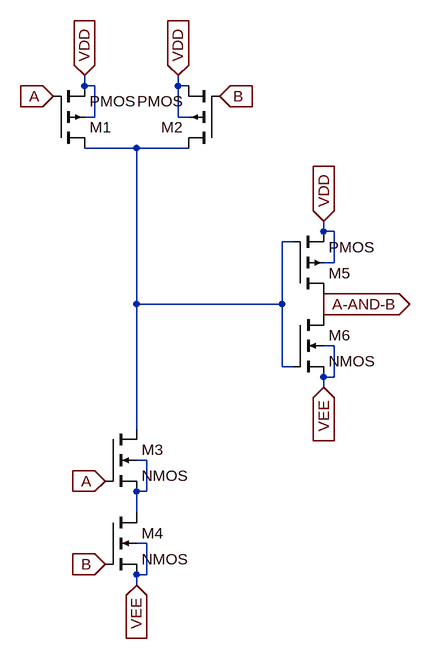
[diagram p0: schematic 2_Input_AND_Gate_Symbol.asc]
2_Input_AND_Gate_Symbol.asc, the LTspice schematic file:
Version 4
SHEET 1 1048 920
WIRE 272 64 272 48
WIRE 288 64 272 64
WIRE 416 64 416 48
WIRE 432 64 416 64
WIRE 288 112 288 64
WIRE 288 112 272 112
WIRE 416 112 416 64
WIRE 432 112 416 112
WIRE 352 160 272 160
WIRE 432 160 352 160
WIRE 640 288 640 272
WIRE 656 288 640 288
WIRE 592 304 576 304
WIRE 656 336 656 288
WIRE 656 336 640 336
WIRE 352 400 352 160
WIRE 576 400 576 304
WIRE 576 400 352 400
WIRE 640 400 640 384
WIRE 640 416 640 400
WIRE 656 464 640 464
WIRE 576 496 576 400
WIRE 592 496 576 496
WIRE 656 512 656 464
WIRE 656 512 640 512
WIRE 640 528 640 512
WIRE 352 592 352 400
WIRE 368 640 352 640
WIRE 368 688 368 640
WIRE 368 688 352 688
WIRE 352 720 352 688
WIRE 368 768 352 768
WIRE 368 816 368 768
WIRE 368 816 352 816
WIRE 352 832 352 816
FLAG 640 400 A-AND-B
IOPIN 640 400 Out
FLAG 224 80 A
IOPIN 224 80 In
FLAG 304 672 A
IOPIN 304 672 In
FLAG 480 80 B
IOPIN 480 80 In
FLAG 304 800 B
IOPIN 304 800 In
FLAG 272 48 VDD
IOPIN 272 48 In
FLAG 416 48 VDD
IOPIN 416 48 In
FLAG 640 272 VDD
IOPIN 640 272 In
FLAG 352 832 VEE
IOPIN 352 832 In
FLAG 640 528 VEE
IOPIN 640 528 In
SYMBOL pmos4 224 160 M180
SYMATTR InstName M1
SYMBOL pmos4 480 160 R180
SYMATTR InstName M2
SYMBOL nmos4 304 592 R0
SYMATTR InstName M3
SYMBOL nmos4 304 720 R0
SYMATTR InstName M4
SYMBOL pmos4 592 384 M180
SYMATTR InstName M5
SYMBOL nmos4 592 416 R0
SYMATTR InstName M6

The netlist it stands for:
* 2_Input_AND_Gate_Symbol.asc
M1 N001 A VDD VDD PMOS
M2 N001 B VDD VDD PMOS
M3 N001 A N002 N002 NMOS
M4 N002 B VEE VEE NMOS
M5 A-AND-B N001 VDD VDD PMOS
M6 A-AND-B N001 VEE VEE NMOS
.model NMOS NMOS
.model PMOS PMOS
.lib standard.mos
.backanno
.end